# EAGLE design nzxt-gamma-usb3 (EAGLE 9.2.1)

## Sheet 1 of 3
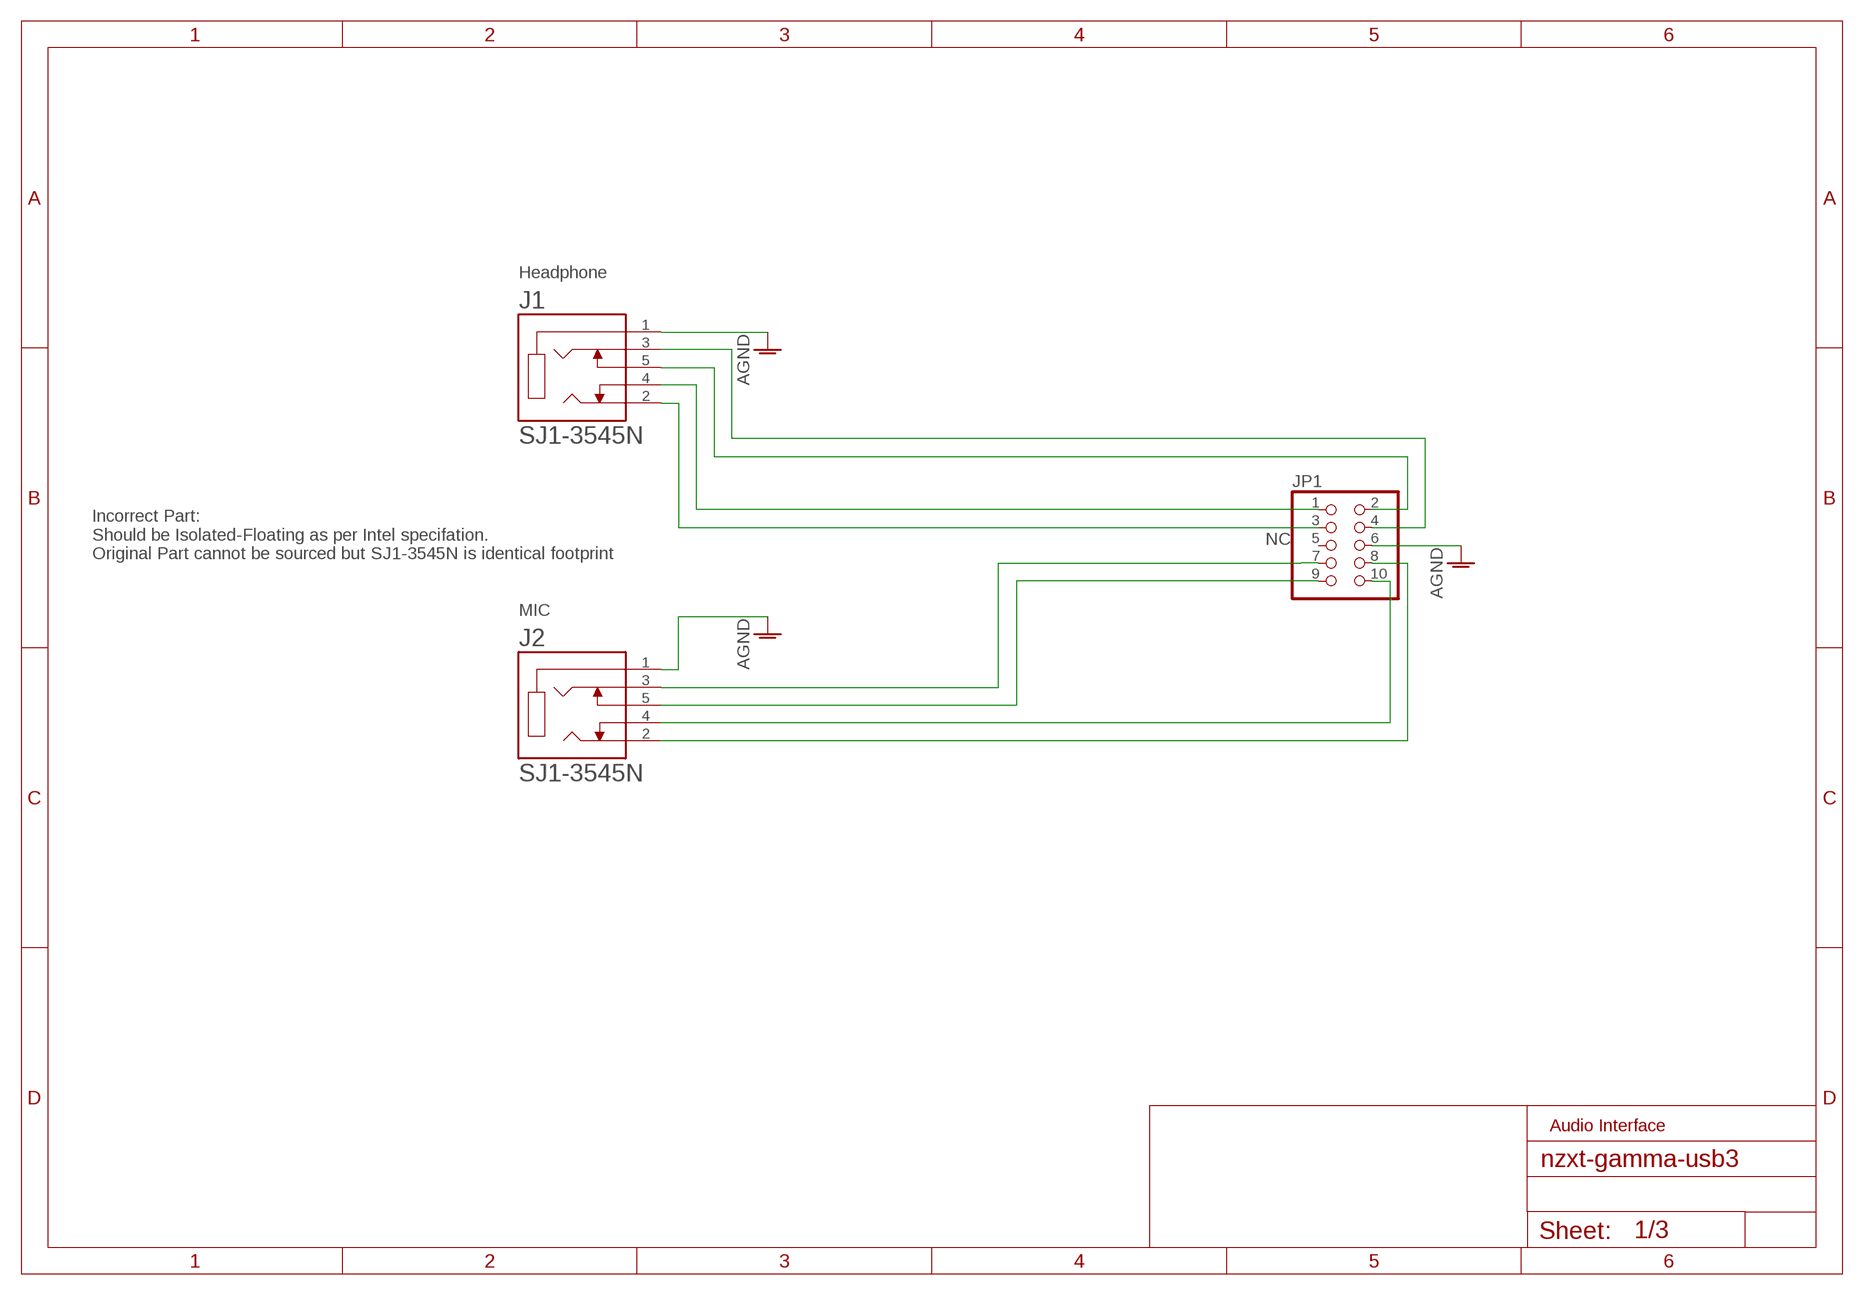
[diagram p0: schematic, sheet 1]

### Parts
J1  SJ1-3545N  [CUI_SJ1-3545N]
J2  SJ1-3545N  [CUI_SJ1-3545N]
JP1  PINHD-2X5  [2X05]

### Nets
AGND: J1.1 J2.1 JP1.6
N$2: J2.2 JP1.8
N$7: J2.5 JP1.9
P_1_R: J2.3 JP1.7
P_2_L: J1.2 JP1.3
P_2_R: J1.3 JP1.4
SENSE1_1_SEND: J1.5 JP1.2
SENSE_1_RET: J2.4 JP1.10
SENSE_2_RET: J1.4 JP1.1
Unconnected: JP1.5

### Notes on the sheet
- Headphone
- Incorrect Part:
  Should be Isolated-Floating as per Intel specifation.
  Original Part cannot be sourced but SJ1-3545N is identical footprint
- NC
- MIC
- Audio Interface

## Sheet 2 of 3
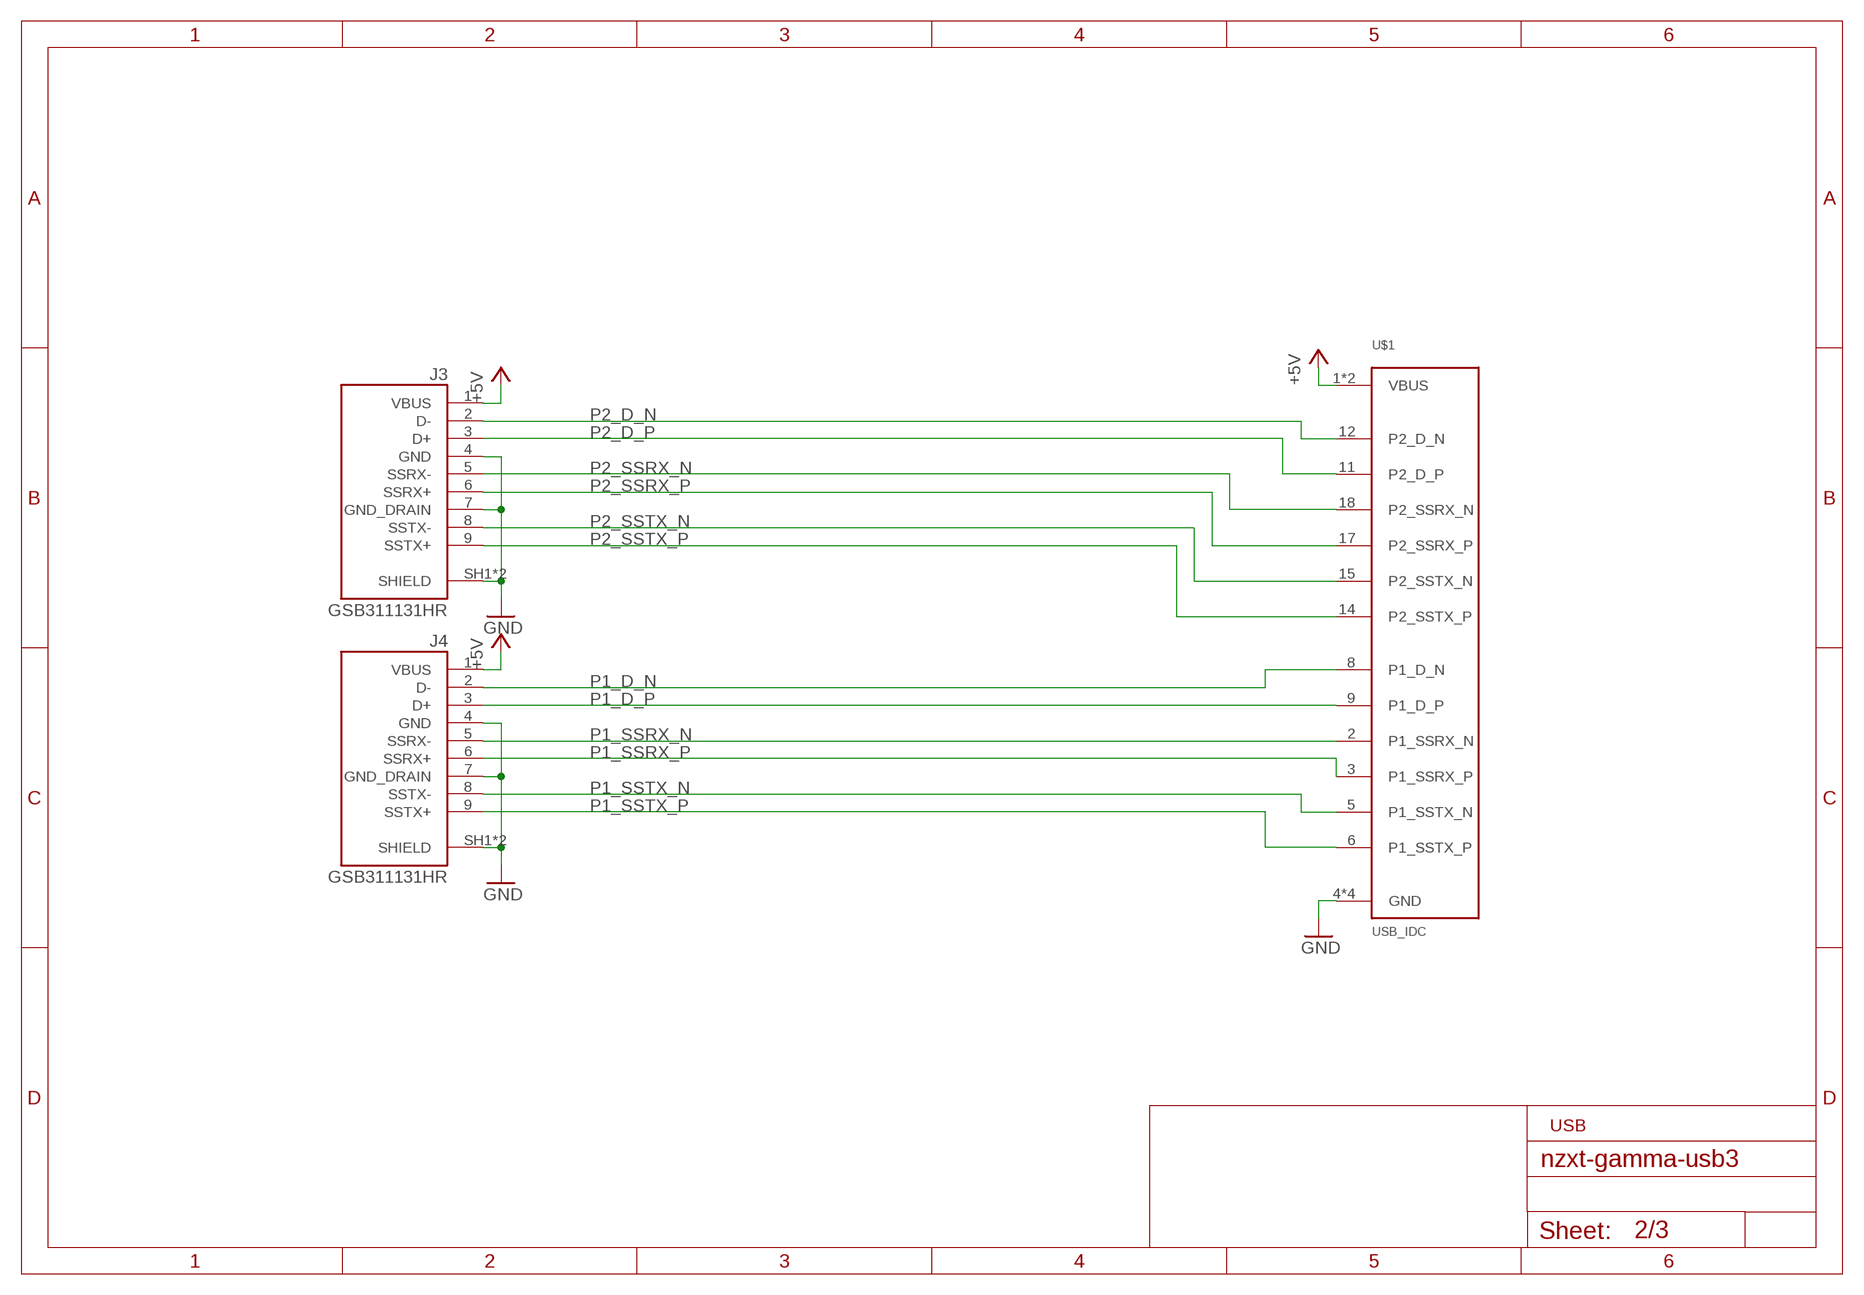
[diagram p1: schematic, sheet 2]

### Parts
J3  GSB311131HR  [AMPHENOL_GSB311131HR]
J4  GSB311131HR  [AMPHENOL_GSB311131HR]
U$1  USB_IDC  [USB3_IDC]

### Nets
+5V: J3.1(VBUS) J4.1(VBUS) U$1.1(VBUS) U$1.19(VBUS)
GND: J3.4(GND) J3.7(GND_DRAIN) J3.SH1(SHIELD) J3.SH2(SHIELD) J4.4(GND) J4.7(GND_DRAIN) J4.SH1(SHIELD) J4.SH2(SHIELD) U$1.4(GND) U$1.7(GND) U$1.13(GND) U$1.16(GND)
P1_D_N: J4.2(D-) U$1.8(P1_D_N)
P1_D_P: J4.3(D+) U$1.9(P1_D_P)
P1_SSRX_N: J4.5(SSRX-) U$1.2(P1_SSRX_N)
P1_SSRX_P: J4.6(SSRX+) U$1.3(P1_SSRX_P)
P1_SSTX_N: J4.8(SSTX-) U$1.5(P1_SSTX_N)
P1_SSTX_P: J4.9(SSTX+) U$1.6(P1_SSTX_P)
P2_D_N: J3.2(D-) U$1.12(P2_D_N)
P2_D_P: J3.3(D+) U$1.11(P2_D_P)
P2_SSRX_N: J3.5(SSRX-) U$1.18(P2_SSRX_N)
P2_SSRX_P: J3.6(SSRX+) U$1.17(P2_SSRX_P)
P2_SSTX_N: J3.8(SSTX-) U$1.15(P2_SSTX_N)
P2_SSTX_P: J3.9(SSTX+) U$1.14(P2_SSTX_P)

### Notes on the sheet
- USB

## Sheet 3 of 3
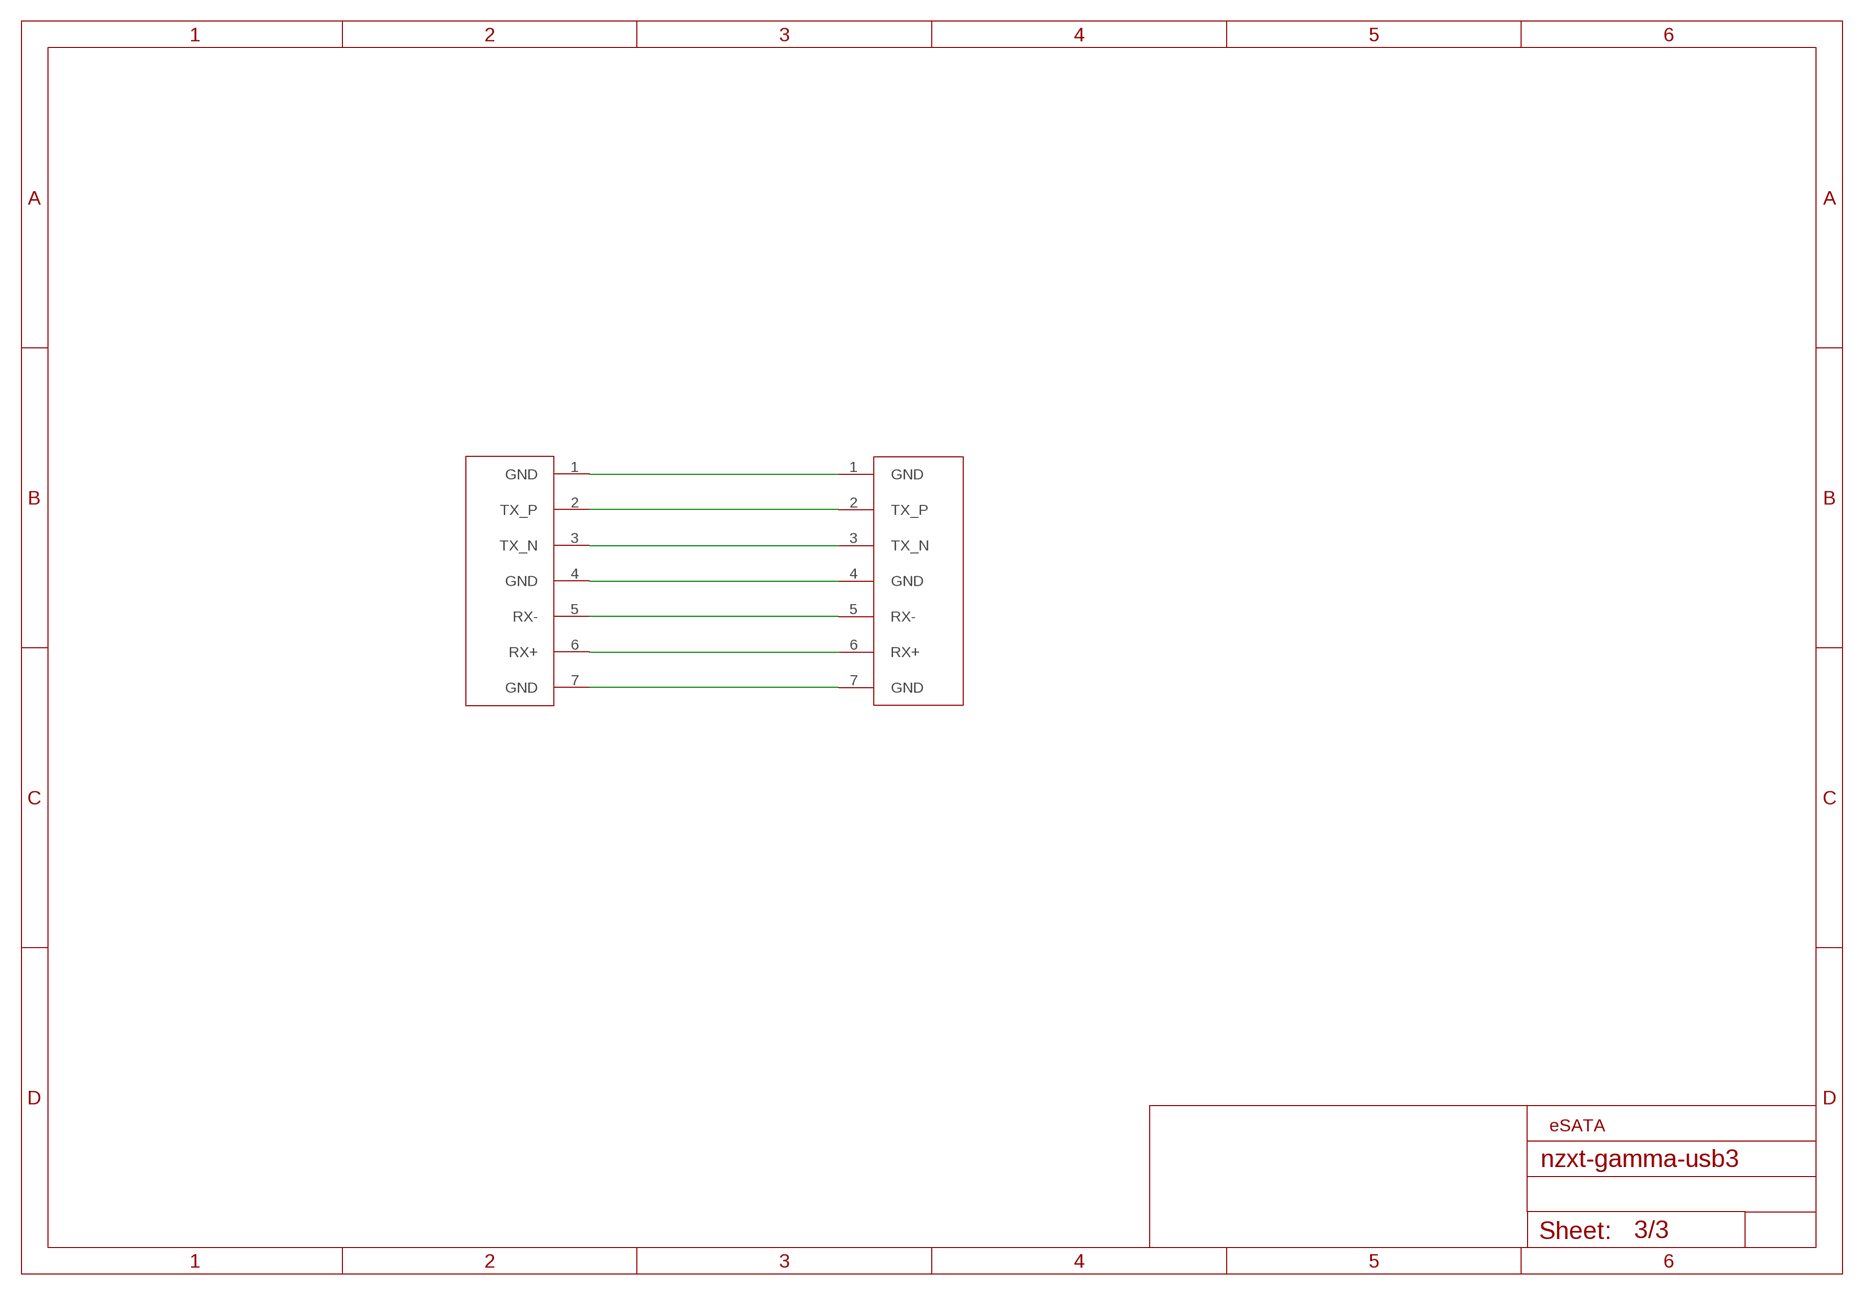
[diagram p2: schematic, sheet 3]

### Parts
U$2  G091208300LF  [G091208300LF]
U$3  0678007001  [0678007001]

### Nets
N$9: U$2.1(GND) U$3.1(GND)
N$10: U$2.4(GND) U$3.4(GND)
N$11: U$2.7(GND) U$3.7(GND)
N$12: U$2.6(RX+) U$3.6(RX+)
N$13: U$2.5(RX-) U$3.5(RX-)
N$14: U$2.3(TX_N) U$3.3(TX_N)
N$15: U$2.2(TX_P) U$3.2(TX_P)

### Notes on the sheet
- eSATA

## Library data of the parts
J1 J2 = dylans-parts:SJ1-3545N: 3.5 mm Right-Angle Stereo Jack, 5 Pin PCB Mount, Non-Threaded; MANUFACTURER: CUI; PARTREV: 1.01; STANDARD: Manufacturer recommendation
J3 J4 = GSB311131HR:GSB311131HR: Conn USB 3.0 Type A RCP 9 POS 2mm Solder RA Thru-Hole 9 Terminal 1 Port T/R; DESCRIPTION: Conn USB 3.0 Type A RCP 9 POS 2mm Solder RA Thru-Hole 9 Terminal 1 Port T/R; MF: Amphenol Commercial; MP: GSB311131HR; PACKAGE: None
JP1 = pinhead:PINHD-2X5: PIN HEADER
U$1 = dylans-parts:USB_IDC
U$2 = dylans-parts:G091208300LF
U$3 = dylans-parts:0678007001; MF: Molex; TYPE: SATA

## Board
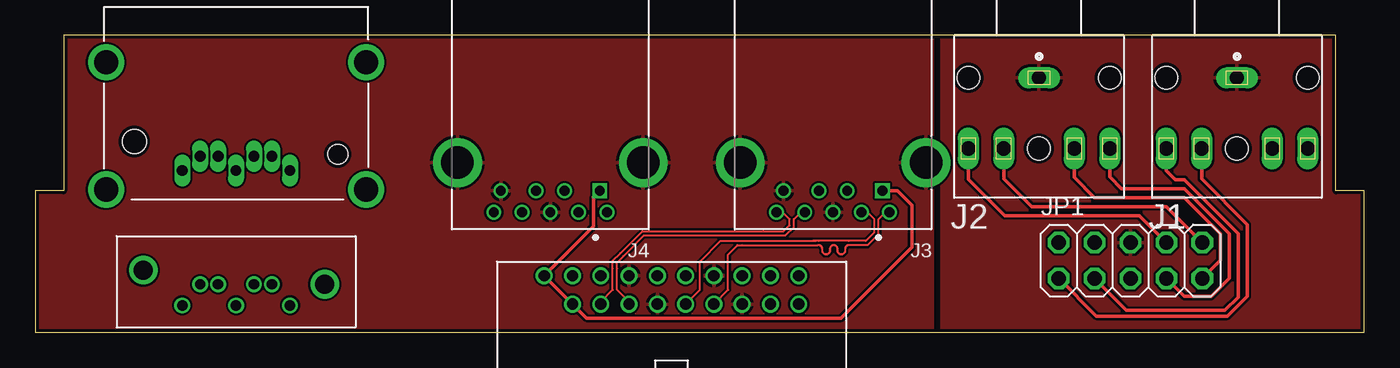
[diagram p3: board, top side]
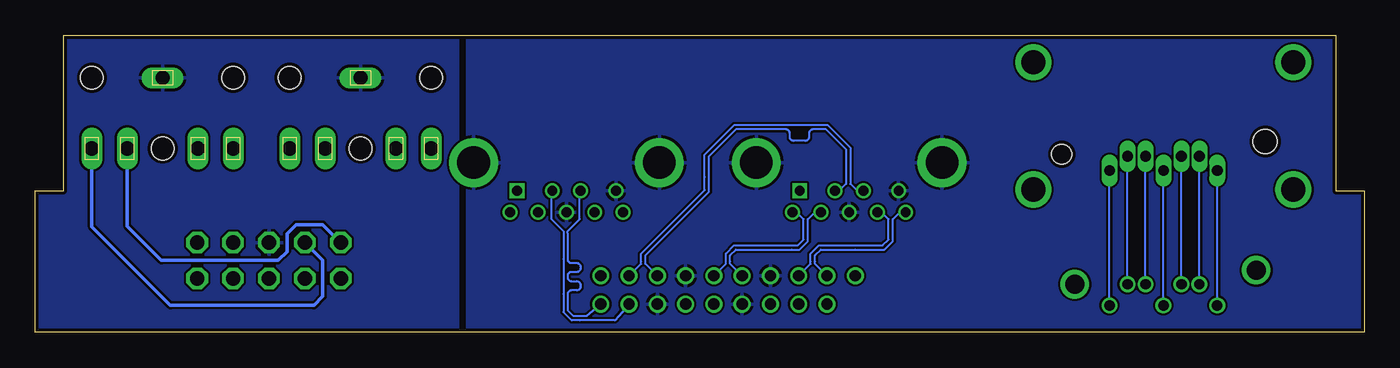
[diagram p4: board, bottom side, seen from below]

Size 94 x 21 mm. Coordinates in mm from the lower left corner, seen from the top.
Outline: 0,0 94,0 94,10 92,10 92,21 2,21 2,10 0,10 0,0
Copper layers (1*16): Top 0.018mm / dielectric 1.55mm / Bottom 0.018mm
Design rules "AllPCB_2Layer *": minimum track width 6mil, minimum drill 0.3mm, track to track 6mil, track to pad 10mil, pad to pad 10mil, via to via 12mil, smd to smd 0mil, copper to edge 10mil, drill to drill 0.35mm, minimum pad ring 0.175mm, minimum via ring 0.15mm, stop-mask expansion 0mil, vias tented up to drill 0.45mm, thermal gap 0.2mm

### Footprints (pad centres in the part's own frame; a part is rotated, then mirrored left to right if it is on the bottom)
CUI_SJ1-3545N = drill 1 long: 1 0,0; 2 5,-5; 3 5,5; 4 5,-2.5; 5 5,2.5 | hole 1.6: 5,0; 0,-5; 0,5
AMPHENOL_GSB311131HR = drill 0.7 square: 1 -3.5,0 | drill 0.7: 2 -1,0; 3 1,0; 4 3.5,0; 5 4,1.5; 6 2,1.5; 7 0,1.5; 8 -2,1.5; 9 -4,1.5 | drill 2.3: SH1 -6.57,-2; SH2 6.57,-2
2X05 = drill 1.016 octagon: 1 -5.08,-1.27; 2 -5.08,1.27; 3 -2.54,-1.27; 4 -2.54,1.27; 5 0,-1.27; 6 0,1.27; 7 2.54,-1.27; 8 2.54,1.27; 9 5.08,-1.27; 10 5.08,1.27
USB3_IDC = drill 0.8: 1 -9,0; 2 -7,0; 3 -5,0; 4 -3,0; 5 -1,0; 6 1,0; 7 3,0; 8 5,0; 9 7,0; 10 9,0; 11 9,-2; 12 7,-2; 13 5,-2; 14 3,-2; 15 1,-2; 16 -1,-2; 17 -3,-2; 18 -5,-2; 19 -7,-2
G091208300LF = drill 0.75 long: 1 -3.81,1.55; 2 -2.54,0.55; 3 -1.27,0.55; 4 0,1.55; 5 1.27,0.55; 6 2.54,0.55; 7 3.81,1.55 | drill 1.7: P$1 -9.2,2.9; P$2 9.2,2.9; P$3 9.2,-6.1; P$4 -9.2,-6.1 | hole 1.4: -7.2,0.4 | hole 1.7: 7.2,-0.5
0678007001 = drill 0.74: 1 3.81,-1.5; 2 2.54,0; 3 1.27,0; 4 0,-1.5; 5 -1.27,0; 6 -2.54,0; 7 -3.81,-1.5 | drill 1.35: MH1 6.27,0; MH2 -6.56,1

### Placement (x,y rotation side)
J1  85,18 270 top
J2  71,18 270 top
J3  56.43,10 180 top
J4  36.43,10 180 top
JP1  77.47,5.08 0 top
U$1  45,4 0 top
U$2  14.2,13 180 top
U$3  14.2,3.4 0 top

### Tracks (layer width: path | path; a pad name or v marks a point on that pad's centre or on a via)
+5V
  Top 0.254: J3.1 61,10 62,9 62,6 57,1 39,1 U$1.19 U$1.1 39.5,7.5 39.5,9.57 J4.1
AGND
  pour Top: 94.61,-0.64 94.61,21.59 90.17,21.59 64.14,21.59 64.14,-0.64
  pour Bottom: 95.25,-1.27 64.14,-1.27 64.14,22.23 95.25,22.23
GND
  pour Top: 63.5,21.5 63.5,-0.5 -0.5,-0.5 -0.5,21.5
  pour Bottom: -1,-1 -1,22 63.5,22 63.5,-1 61,-1
N$2
  Top 0.254: 79.76,6.6 JP1.8 78.11,8.26 68.58,8.26 66,10.84 J2.2
N$7
  Top 0.254: JP1.9 83.82,5.08 83.82,6.99 81.28,9.53 74.93,9.53 73.5,10.96 J2.5
N$9
  Bottom 0.152: U$3.1 U$2.1
N$10
  Bottom 0.152: U$3.4 U$2.4
N$11
  Bottom 0.152: U$3.7 U$2.7
N$12
  Bottom 0.152: U$3.6 U$2.6
N$13
  Bottom 0.152: U$3.5 U$2.5
N$14
  Bottom 0.152: U$3.3 U$2.3
N$15
  Bottom 0.152: U$3.2 U$2.2
P1_D_N
  Bottom 0.152: U$1.8 50.85,4.85 50.85,5 50.85,5.44 46.35,9.94 46.35,11 46.35,12.44 44.44,14.35 40.9,14.35 arc90 40.63,14.08 40.63,13.81 arc-90 40.37,13.54 39.53,13.54 arc-90 39.27,13.81 39.27,14.08 arc90 39,14.35 38.06,14.35 36.65,12.94 36.65,10.5 37.15,10 J4.2
P1_D_P
  Bottom 0.152: U$1.9 51.15,4.85 51.15,5 51.15,5.56 46.65,10.06 46.65,11 46.65,12.56 44.56,14.65 40.9,14.65 39,14.65 37.94,14.65 36.35,13.06 36.35,10.5 35.85,10 J4.3
P1_SSRX_N
  Bottom 0.152: U$1.2 38.85,4.85 38.85,5 38.85,5.44 38.44,5.85 36,5.85 33.94,5.85 33.35,6.44 33.35,8 32.85,8.5 J4.5
P1_SSRX_P
  Bottom 0.152: U$1.3 39.15,4.85 39.15,5 39.15,5.56 38.56,6.15 36,6.15 34.06,6.15 33.65,6.56 33.65,8 34.15,8.5 J4.6
P1_SSTX_N
  Bottom 0.152: U$1.5 44.85,4.85 44.85,5 44.85,5.44 44.44,5.85 40.5,5.85 39.94,5.85 39.35,6.44 39.35,8 38.85,8.5 J4.8
P1_SSTX_P
  Bottom 0.152: U$1.6 45.15,4.85 45.15,5 45.15,5.56 44.56,6.15 40.5,6.15 40.06,6.15 39.65,6.56 39.65,8 40.15,8.5 J4.9
P2_D_N
  Bottom 0.152: U$1.12 53,0.85 55.5,0.85 56.06,0.85 56.65,1.44 56.65,2.7 56.65,5.17 56.65,7.15 57.5,8 57.5,9.93 J3.2
P2_D_P
  Bottom 0.152: U$1.11 55,1.15 55.5,1.15 55.94,1.15 56.35,1.56 56.35,2.7 arc90 56.08,2.97 55.7,2.97 arc-90 55.44,3.23 55.44,3.35 arc-90 55.7,3.61 56.08,3.61 arc90 56.35,3.88 56.35,3.99 arc90 56.08,4.26 55.7,4.26 arc-90 55.44,4.53 55.44,4.64 arc-90 55.7,4.91 56.08,4.91 arc90 56.35,5.17 56.35,7 56.35,7.15 55.5,8 55.5,9.93 J3.3
P2_SSRX_N
  Top 0.152: U$1.18 40,2.15 40.85,3 40.85,4.5 40.85,5.06 41.39,5.61 42.94,7.15 51.5,7.15 52.94,7.15 53.35,7.56 53.35,8 52.85,8.5 J3.5
P2_SSRX_P
  Top 0.152: U$1.17 42,2.15 41.15,3 41.15,4.5 41.15,4.94 41.61,5.39 43.06,6.85 51.5,6.85 53.06,6.85 53.65,7.44 53.65,8 54.15,8.5 J3.6
P2_SSTX_N
  Top 0.152: 50,6.47 55,6.47 | 55,6.47 55.2,6.47 | U$1.15 47,3 47,5 48.47,6.47 50,6.47 | 49.97,6.47 50,6.47 | 55,6.47 | 55,6.47 55.4,6.47 57.55,6.47 58.75,6.47 59.35,7.06 59.35,8 58.85,8.5 J3.8
P2_SSTX_P
  Top 0.152: 55.33,6.16 50,6.16 49.66,6.16 49,5.5 49,3 U$1.14 | 55.33,6.16 | 55.33,6.16 55.4,6.16 arc-90 55.67,5.9 55.67,5.77 arc90 55.93,5.51 55.94,5.51 arc90 56.21,5.77 56.21,5.9 arc-90 56.47,6.16 56.48,6.16 arc-90 56.75,5.9 56.75,5.77 arc90 57.01,5.51 57.02,5.51 arc90 57.29,5.77 57.29,5.9 arc-90 57.55,6.16 58.88,6.16 59.65,6.94 59.65,8 60.15,8.5 J3.9
P_1_R
  Top 0.254: JP1.7 81.28,2.54 83.19,2.54 84.45,3.81 84.45,6.99 81.28,10.16 76.83,10.16 76,10.99 J2.3
P_2_L
  Top 0.254: JP1.3 77.19,1.55 84.16,1.55 85.09,2.48 85.09,6.99 81.28,10.79 80.64,10.79 80,11.44 J1.2
P_2_R
  Bottom 0.254: J1.3 90,7.45 84.45,1.91 74.3,1.91 73.66,2.54 73.66,5.08 JP1.4
SENSE1_1_SEND
  Bottom 0.254: JP1.2 73.66,7.62 75.56,7.62 76.2,6.99 76.2,5.71 76.83,5.08 85.09,5.08 87.5,7.49 J1.5
SENSE_1_RET
  Top 0.254: JP1.10 80.01,8.89 70.48,8.89 68.5,10.88 J2.4
SENSE_2_RET
  Top 0.254: JP1.1 75.06,1.14 84.33,1.14 85.72,2.54 85.72,7.62 82.5,10.85 J1.4